# Altium schematic sheet BLDC_Prototype.SchDoc
size A4
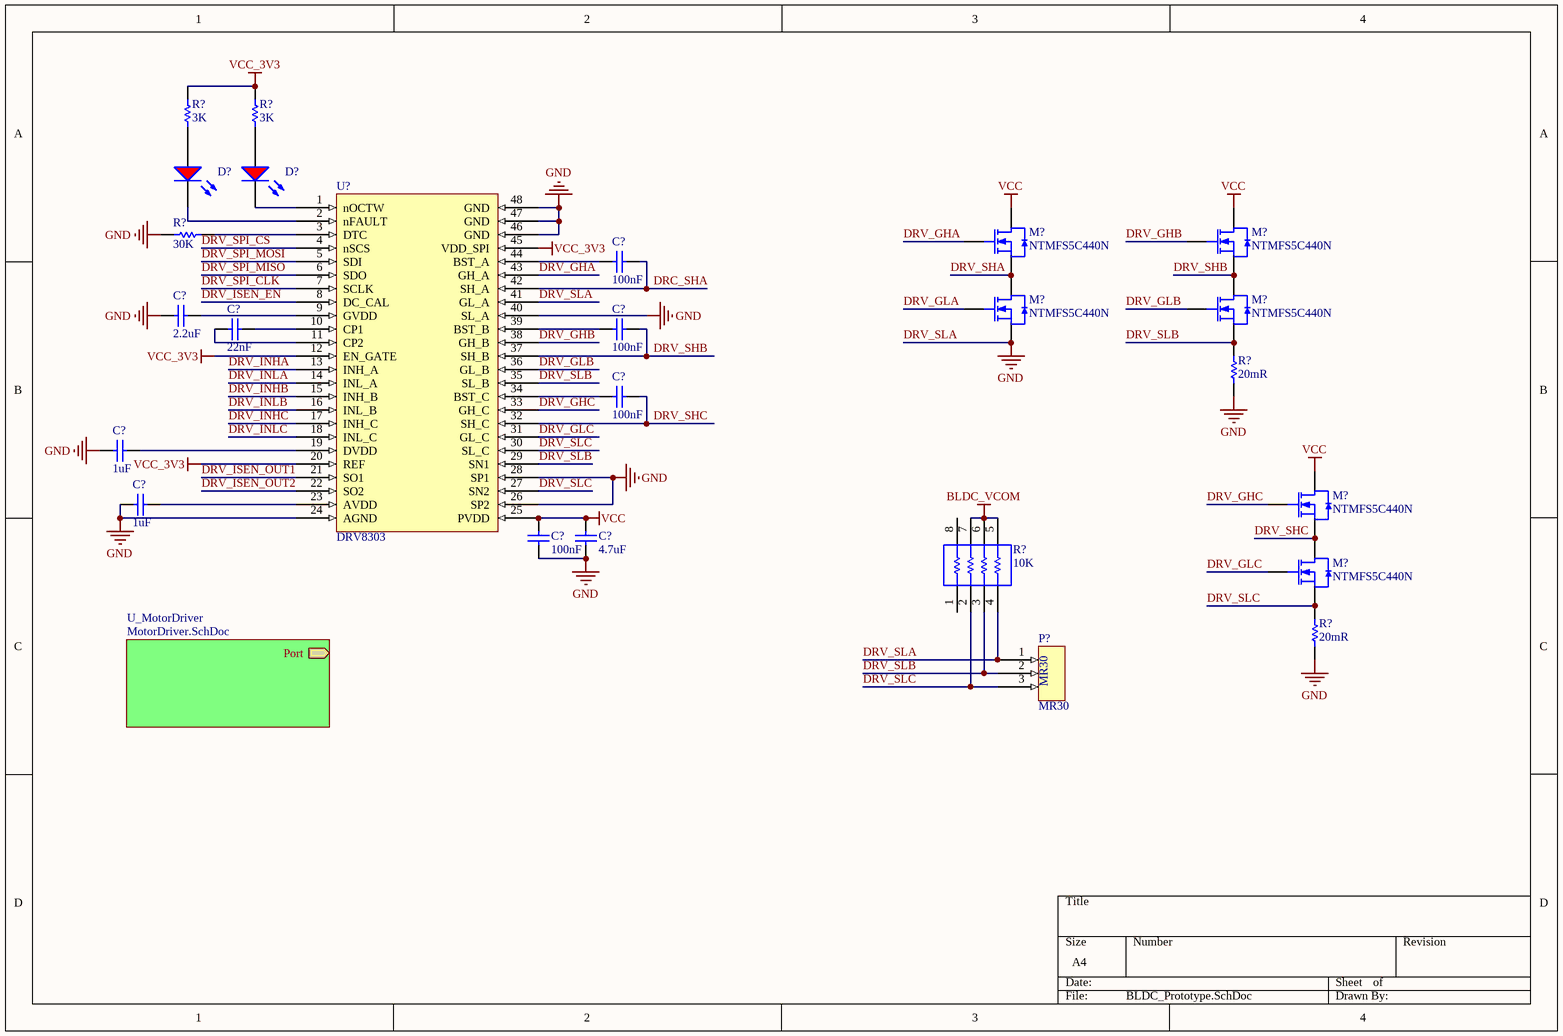
[diagram p0: BLDC_Prototype.SchDoc]

## Parts
(Parts that share a designator on the sheet are numbered #1, #2 ... from top to bottom, then left to right.)
C?#1  100nF  [SMC_0805]
C?#2  2.2uF  [SMC_0805]
C?#3  22nF  [SMC_0805]
C?#4  100nF  [SMC_0805]
C?#5  100nF  [SMC_0805]
C?#6  1uF  [SMC_0805]
C?#7  1uF  [SMC_0805]
C?#8  100nF  [SMC_0805]
C?#9  4.7uF  [SMC_0805]
D?#1  (no value)  [SMLED_0603]
D?#2  (no value)  [SMLED_0603]
M?#1  NTMFS5C440N  [PSON127P620X100-8N]
M?#2  NTMFS5C440N  [PSON127P620X100-8N]
M?#3  NTMFS5C440N  [PSON127P620X100-8N]
M?#4  NTMFS5C440N  [PSON127P620X100-8N]
M?#5  NTMFS5C440N  [PSON127P620X100-8N]
M?#6  NTMFS5C440N  [PSON127P620X100-8N]
P?  MR30  [MR30PW-FB]
R?#1  3K  [SMR_0805]
R?#2  3K  [SMR_0805]
R?#3  30K  [SMR_0805]
R?#4  20mR  [SMR_2512]
R?#5  10K  [SMR_0402x4]
R?#6  20mR  [SMR_2512]
U?  DRV8303  [TSSOP50P810X120_HS-49L]

## Sub-sheets
U_MotorDriver = MotorDriver.SchDoc: Port (out)

## Nets
BLDC_VCOM: R?#5.5 R?#5.6 R?#5.7
DRV_SLA: C?#2.1 C?#6.1 C?#7.1 C?#8.1 C?#9.1 M?#3.S P?.1 R?#3.1 R?#4.1 R?#5.4 R?#6.1 U?.24(AGND) U?.26(SP2) U?.28(SP1) U?.40(SL_A) U?.41(GL_A) U?.46(GND) U?.47(GND) U?.48(GND)  [also labelled GND]
VCC: C?#8.2 C?#9.2 M?#1.D M?#2.D M?#5.D U?.25(PVDD)
VCC_3V3: R?#1.1 R?#2.1 U?.12(EN_GATE) U?.20(REF) U?.45(VDD_SPI)
DRC_SHA: C?#1.2 U?.42(SH_A)
DRV_GHA: M?#1.G U?.43(GH_A)
DRV_GHB: M?#2.G U?.38(GH_B)
DRV_GHC: M?#5.G U?.33(GH_C)
DRV_GLA: M?#3.G
DRV_GLB: M?#4.G U?.36(GL_B)
DRV_GLC: M?#6.G U?.31(GL_C)
DRV_INHA: U?.13(INH_A)
DRV_INHB: U?.15(INH_B)
DRV_INHC: U?.17(INH_C)
DRV_INLA: U?.14(INL_A)
DRV_INLB: U?.16(INL_B)
DRV_INLC: U?.18(INL_C)
DRV_ISEN_EN: U?.8(DC_CAL)
DRV_ISEN_OUT1: U?.21(SO1)
DRV_ISEN_OUT2: U?.22(SO2)
DRV_SHA: M?#1.S M?#3.D
DRV_SHB: C?#4.2 M?#2.S M?#4.D U?.37(SH_B)
DRV_SHC: C?#5.2 M?#5.S M?#6.D U?.32(SH_C)
DRV_SLB: M?#4.S P?.2 R?#4.2 R?#5.3 U?.29(SN1) U?.35(SL_B)
DRV_SLC: M?#6.S P?.3 R?#5.2 R?#6.2 U?.27(SN2) U?.30(SL_C)
DRV_SPI_CLK: U?.7(SCLK)
DRV_SPI_CS: U?.4(nSCS)
DRV_SPI_MISO: U?.6(SDO)
DRV_SPI_MOSI: U?.5(SDI)
NetC?#1_1: C?#1.1 U?.44(BST_A)
NetC?#2_2: C?#2.2 U?.9(GVDD)
NetC?#3_1: C?#3.1 U?.11(CP2)
NetC?#3_2: C?#3.2 U?.10(CP1)
NetC?#4_1: C?#4.1 U?.39(BST_B)
NetC?#5_1: C?#5.1 U?.34(BST_C)
NetC?#6_2: C?#6.2 U?.19(DVDD)
NetC?#7_2: C?#7.2 U?.23(AVDD)
NetD?#1_A: D?#1.A R?#1.2
NetD?#1_K: D?#1.K U?.2(nFAULT)
NetD?#2_A: D?#2.A R?#2.2
NetD?#2_K: D?#2.K U?.1(nOCTW)
NetR?#3_2: R?#3.2 U?.3(DTC)

Not connected (* = marked no-connect by the designer): R?#5 1 8

## Library data of the parts
C?#1-C?#9 = Cap Ceramic
D?#1 D?#2 = LED_Red
R?#1-R?#4 R?#6 = Res SMT
R?#5 = Res Array x 4